# Altium schematic sheet Sensor-LED.SchDoc
size A4; SheetNumber: 2; SheetTotal: 3
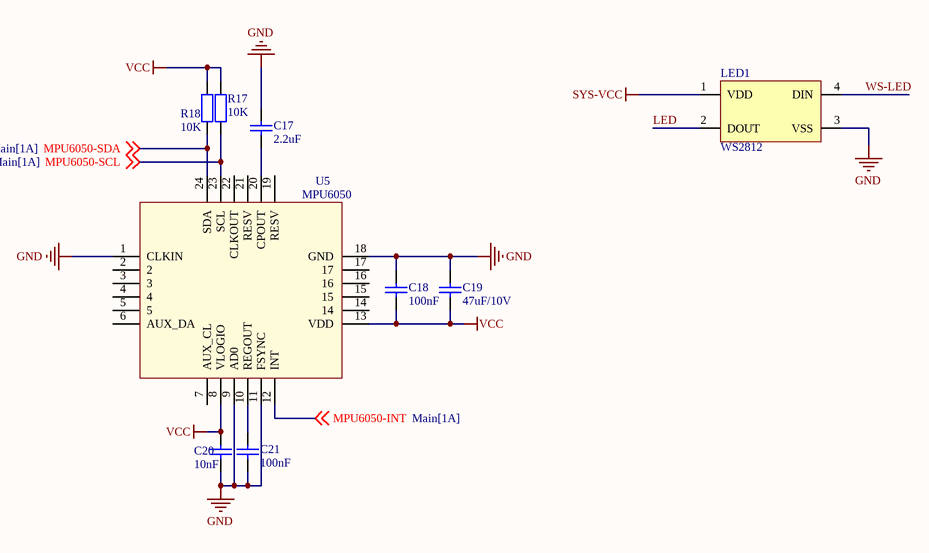
[diagram p0: Sensor-LED.SchDoc]

## Parts
C17  2.2uF  [C0402_M]
C18  100nF  [C0402_M]
C19  47uF/10V  [C0402_M]
C20  10nF  [C0402_M]
C21  100nF  [C0402_M]
LED1  WS2812  [LED 3535]
R17  10K  [R0402_M]
R18  10K  [R0402_M]
U5  MPU6050  [QFN24 4x4_M]

## Nets
GND: C17.2 C18.2 C19.2 C20.1 C21.1 LED1.3(VSS) U5.1(CLKIN) U5.9(AD0) U5.11(FSYNC) U5.18(GND)
SYS-VCC: LED1.1(VDD)
VCC: C18.1 C19.1 C20.2 R17.1 R18.1 U5.8(VLOGIO) U5.13(VDD)
LED: LED1.2(DOUT)
MPU6050-INT: U5.12(INT) ; off-sheet MPU6050-INT
MPU6050-SCL: R17.2 U5.23(SCL) ; off-sheet MPU6050-SCL
MPU6050-SDA: R18.2 U5.24(SDA) ; off-sheet MPU6050-SDA
WS-LED: LED1.4(DIN)
NetC17_1: C17.1 U5.20(CPOUT)
NetC21_2: C21.2 U5.10(REGOUT)

Not connected (* = marked no-connect by the designer): U5 2 3 4 5 6(AUX_DA) 7(AUX_CL) 14 15 16 17 19(RESV) 21(RESV) 22(CLKOUT)

## Library data of the parts
C17-C21 = C: 贴片电容/MLCC电容; BOM名称: 无极性贴片电容; 联系下单店铺卖家 免费帮你查找封装: 联系下单店铺卖家 免费技术支持
R17 R18 = R: 贴片电阻; 联系下单店铺卖家 免费帮你查找封装: 联系下单店铺卖家 免费技术支持; BOM名称: 贴片电阻
U5 = MPU6050: 三轴加速度+三轴陀螺仪; 联系卖家 免费查找封装: 唯一出售店铺网址https://shop463601444.taobao.com; 封装库来自淘宝卖家：黄晶宝石: 其他店铺购入均为盗版封装库，请立即申请退款，本店现金奖励100~500元